# EAGLE design Stepper L647x (EAGLE 6.2)
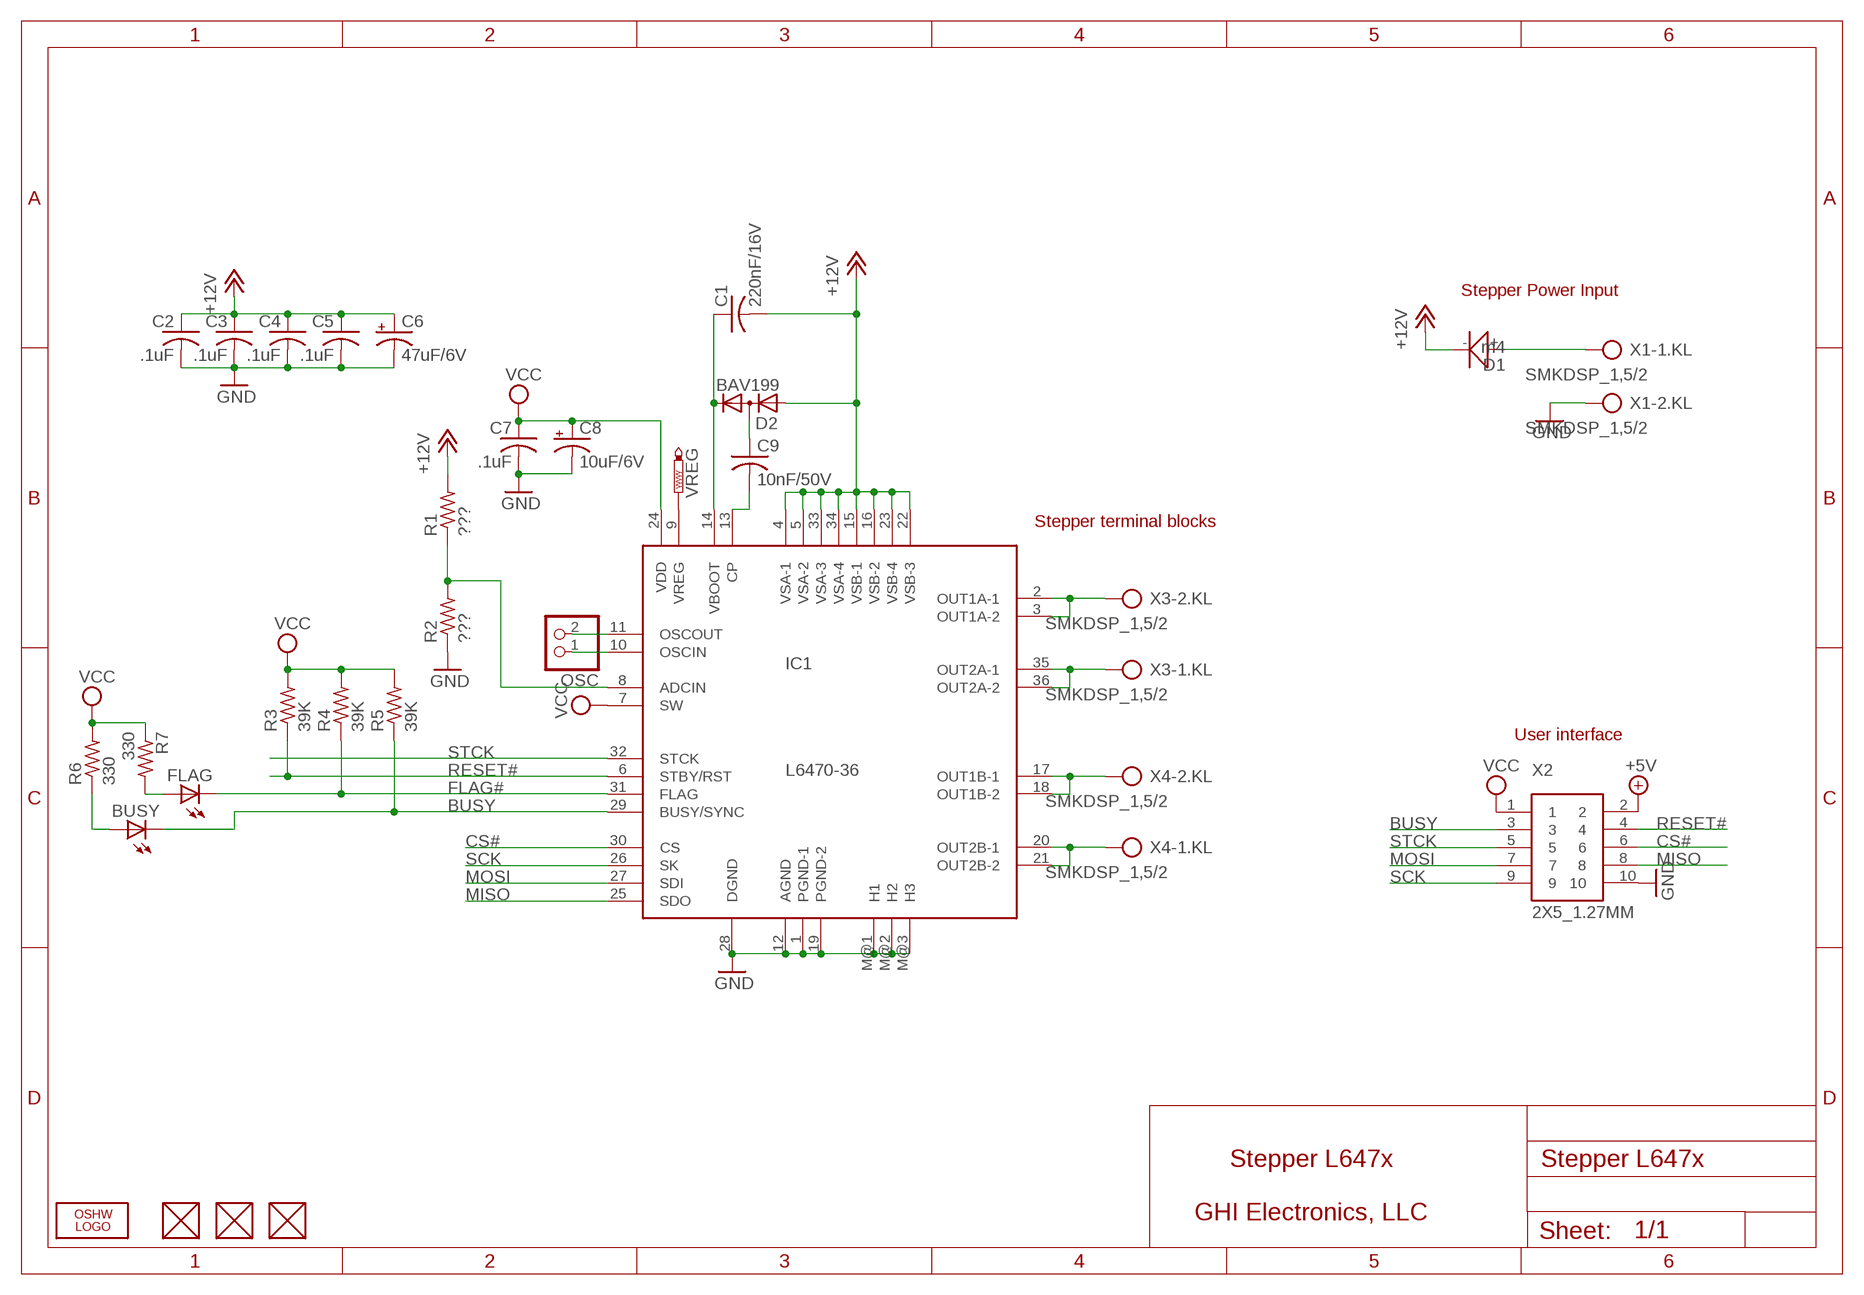
[diagram p0: schematic, sheet 1]

## Parts
BUSY  LEDCHIPLED_0805  [CHIPLED_0805]
C1  220nF/16V  C-USC0603K  [C0603K]
C2  .1uF  C-USC0603K  [C0603K]
C3  .1uF  C-USC0603K  [C0603K]
C4  .1uF  C-USC0603K  [C0603K]
C5  .1uF  C-USC0603K  [C0603K]
C6  47uF/6V  CPOL-USCT3528  [CT3528]
C7  .1uF  C-USC0603K  [C0603K]
C8  10uF/6V  CPOL-USCT3528  [CT3528]
C9  10nF/50V  C-USC0603K  [C0603K]
D1  m4  010-D2010  [D2010]
D2  BAV199  [SOT23]
FLAG  LEDCHIPLED_0805  [CHIPLED_0805]
FUD1  FIDUCIAL  [FIDUCIAL_40MIL]
FUD2  FIDUCIAL  [FIDUCIAL_40MIL]
FUD3  FIDUCIAL  [FIDUCIAL_40MIL]
IC1  L6470-36  [PSO36]
LOGO1  LOGO-OSHW-FILLX0200-NT  [OSHW_FILLX200_NOTEXT]
OSC  PINHD-1X2  [1X02]
R1  ???  R-US_R0603  [R0603]
R2  ???  R-US_R0603  [R0603]
R3  39K  R-US_R0603  [R0603]
R4  39K  R-US_R0603  [R0603]
R5  39K  R-US_R0603  [R0603]
R6  330  R-US_R0603  [R0603]
R7  330  R-US_R0603  [R0603]
VREG  PTR1PAD1-13  [P1-13]
X1  SMKDSP_1,5/2  [SMKDSP_1,5/2]
X2  2X5_1.27MM  [2X5_1.27MM]
X3  SMKDSP_1,5/2  [SMKDSP_1,5/2]
X4  SMKDSP_1,5/2  [SMKDSP_1,5/2]

## Nets
+5V [power]: X2.2
+12V: C1.2 C2.1 C3.1 C4.1 C5.1 C6.+ D1.- D2.1(A) IC1.4(VSA-1) IC1.5(VSA-2) IC1.15(VSB-1) IC1.16(VSB-2) IC1.22(VSB-3) IC1.23(VSB-4) IC1.33(VSA-3) IC1.34(VSA-4) R1.2
BUSY: BUSY.C IC1.29(BUSY/SYNC) R5.1 X2.3
CS#: IC1.30(CS) X2.6
FLAG#: FLAG.C IC1.31(FLAG) R4.1
GND: C2.2 C3.2 C4.2 C5.2 C6.- C7.2 C8.- IC1.1(PGND-1) IC1.12(AGND) IC1.19(PGND-2) IC1.28(DGND) IC1.M@1(H1) IC1.M@2(H2) IC1.M@3(H3) R2.1 X1.2 X2.10
MISO: IC1.25(SDO) X2.8
MOSI: IC1.27(SDI) X2.7
N$1: IC1.2(OUT1A-1) IC1.3(OUT1A-2) X3.2
N$2: IC1.35(OUT2A-1) IC1.36(OUT2A-2) X3.1
N$3: IC1.17(OUT1B-1) IC1.18(OUT1B-2) X4.2
N$4: C9.2 IC1.13(CP)
N$5: IC1.20(OUT2B-1) IC1.21(OUT2B-2) X4.1
N$6: D1.+ X1.1
N$7: C9.1 D2.3(AC)
N$8: C1.1 D2.2(C) IC1.14(VBOOT)
N$9: IC1.9(VREG) VREG.TP
N$10: FLAG.A R7.2
N$12: IC1.10(OSCIN) OSC.1
N$14: IC1.11(OSCOUT) OSC.2
N$16: IC1.8(ADCIN) R1.1 R2.2
N$18: BUSY.A R6.1
RESET#: IC1.6(STBY/RST) R3.1 X2.4
SCK: IC1.26(SK) X2.9
STCK: IC1.32(STCK) X2.5
VCC: C7.1 C8.+ IC1.7(SW) IC1.24(VDD) R3.2 R4.2 R5.2 R6.2 R7.1 X2.1
Unconnected: FUD1.P$1 FUD2.P$1 FUD3.P$1

## Notes on the sheet
- Stepper Power Input
- Stepper terminal blocks
- User interface
- Stepper L647x
- GHI Electronics, LLC

## Library data of the parts
BUSY FLAG = led:LED: LED OSRAM: - CHIPLED LG R971, LG N971, LY N971, LG Q971, LY Q971, LO R971, LY R971 LH N974, LH R974 LS Q976, LO Q976, LY Q976 LO Q996 - Hyper CHIPLED LW Q18S LB Q993, LB Q99A, LB R99A - SideLED LS A670, LO A670, LY A670, LG A670, LP A670 LB A673, LV A673, LT A673, LW A673 LH A674 LY A675 LS A676, LA A676, LO A676, LY A676, LW A676 LS A679, LY A679, LG A679 - Hyper Micro SIDELED® LS Y876, LA Y876, LO Y876, LY Y876 LT Y87S - SmartLED LW L88C, LW L88S LB L89C, LB L89S, LG L890 LS L89K, LO L89K, LY L89K LS L896, LA L896, LO L896, LY L896 - TOPLED LS T670, LO T670, LY T670, LG T670, LP T670 LSG T670, LSP T670, LSY T670, LOP T670, LYG T670 LG T671, LOG T671, LSG T671 LB T673, LV T673, LT T673, LW T673 LH T674 LS T676, LA T676, LO T676, LY T676, LB T676, LH T676, LSB T676, LW T676 LB T67C, LV T67C, LT T67C, LS T67K, LO T67K, LY T67K, LW E67C LS E67B, LA E67B, LO E67B, LY E67B, LB E67C, LV E67C, LT E67C LW T67C LS T679, LY T679, LG T679 LS T770, LO T770, LY T770, LG T770, LP T770 LB T773, LV T773, LT T773, LW T773 LH T774 LS E675, LA E675, LY E675, LS T675 LS T776, LA T776, LO T776, LY T776, LB T776 LHGB T686 LT T68C, LB T68C - Hyper Mini TOPLED® LB M676 - Mini TOPLED Santana® LG M470 LS M47K, LO M47K, LY M47K Source: http://www.osram.convergy.de LUXEON: - LUMILED® LXK2-PW12-R00, LXK2-PW12-S00, LXK2-PW14-U00, LXK2-PW14-V00 LXK2-PM12-R00, LXK2-PM12-S00, LXK2-PM14-U00 LXK2-PE12-Q00, LXK2-PE12-R00, LXK2-PE12-S00, LXK2-PE14-T00, LXK2-PE14-U00 LXK2-PB12-K00, LXK2-PB12-L00, LXK2-PB12-M00, LXK2-PB14-N00, LXK2-PB14-P00, LXK2-PB14-Q00 LXK2-PR12-L00, LXK2-PR12-M00, LXK2-PR14-Q00, LXK2-PR14-R00 LXK2-PD12-Q00, LXK2-PD12-R00, LXK2-PD12-S00 LXK2-PH12-R00, LXK2-PH12-S00 LXK2-PL12-P00, LXK2-PL12-Q00, LXK2-PL12-R00 Source: www.luxeon.com KINGBRIGHT: KA-3528ASYC Source: www.kingbright.com
C1-C5 C7 C9 = rcl:C-US: CAPACITOR, American symbol
C6 C8 = rcl:CPOL-US: POLARIZED CAPACITOR, American symbol
D1 = Discrete:010-D*
D2 = diode:BAV199: DIODE low-leakage double diode
FUD1-FUD3 = GHI:FIDUCIAL
IC1 = GHI:L6470-36
LOGO1 = Logo:LOGO-OSHW-FILL
OSC = pinhead:PINHD-1X2: PIN HEADER
R1-R7 = rcl:R-US_: RESISTOR, American symbol
VREG = testpad:PTR1: TEST PIN
X1 X3 X4 = GHI2:SMKDSP_1,5/2: For Blue Wire Connector Block
X2 = GHI:2X5_1.27MM

## Net classes
0 default: width 0.254 mm, drill 0.381 mm, clearance 0.203 mm

## Board
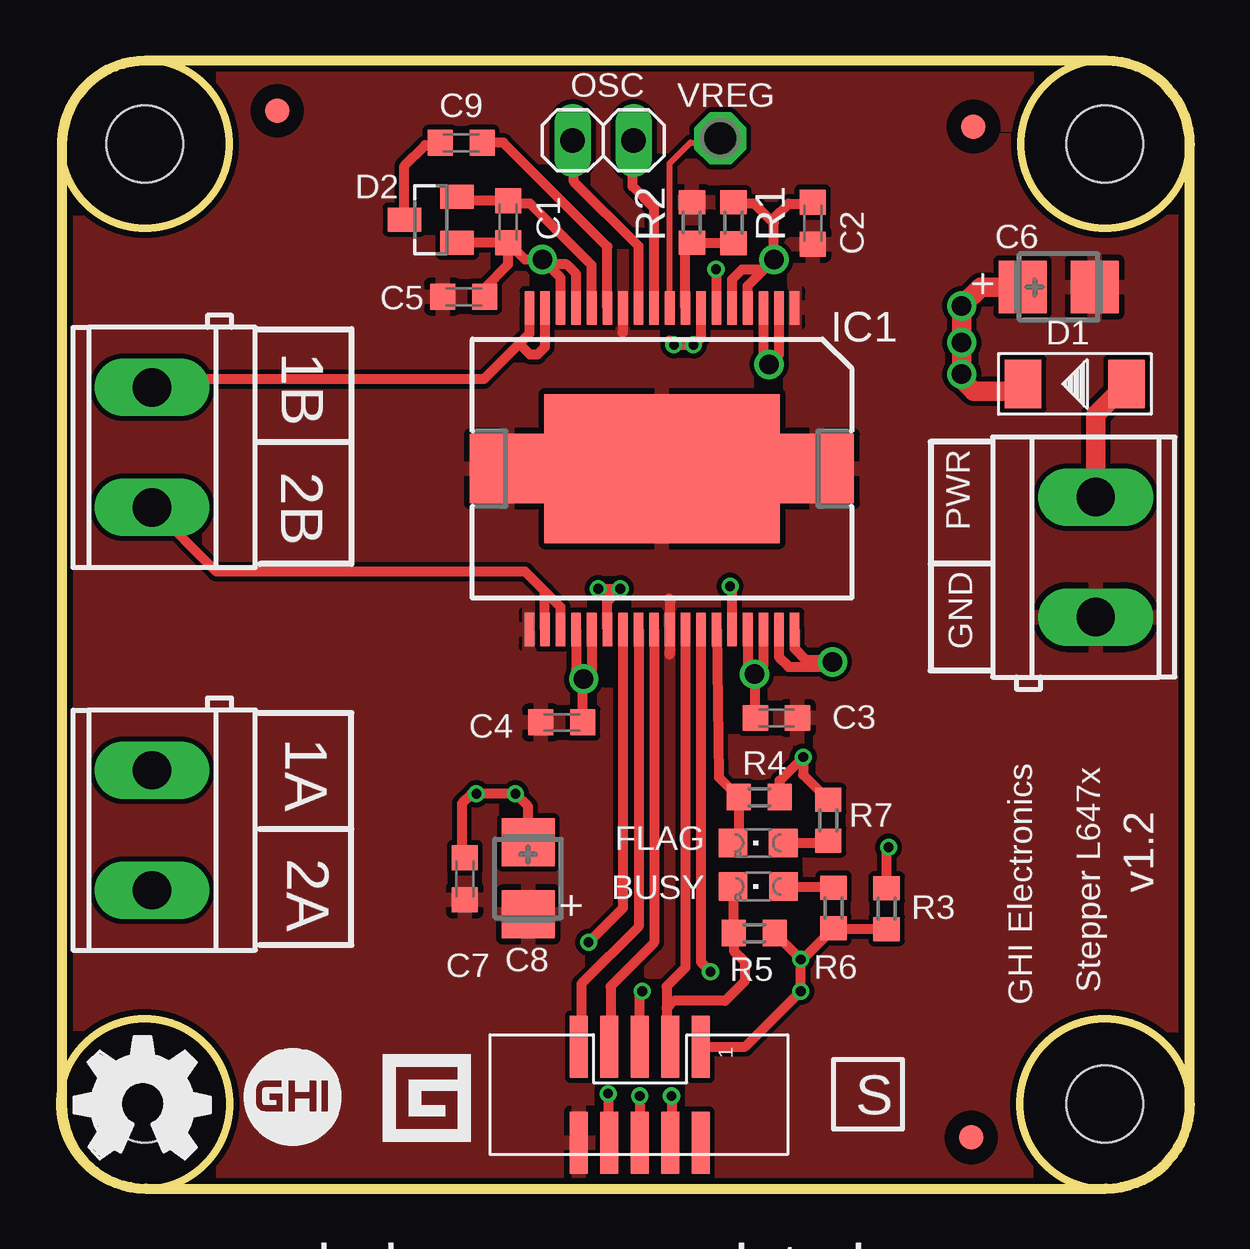
[diagram p1: board, top side]
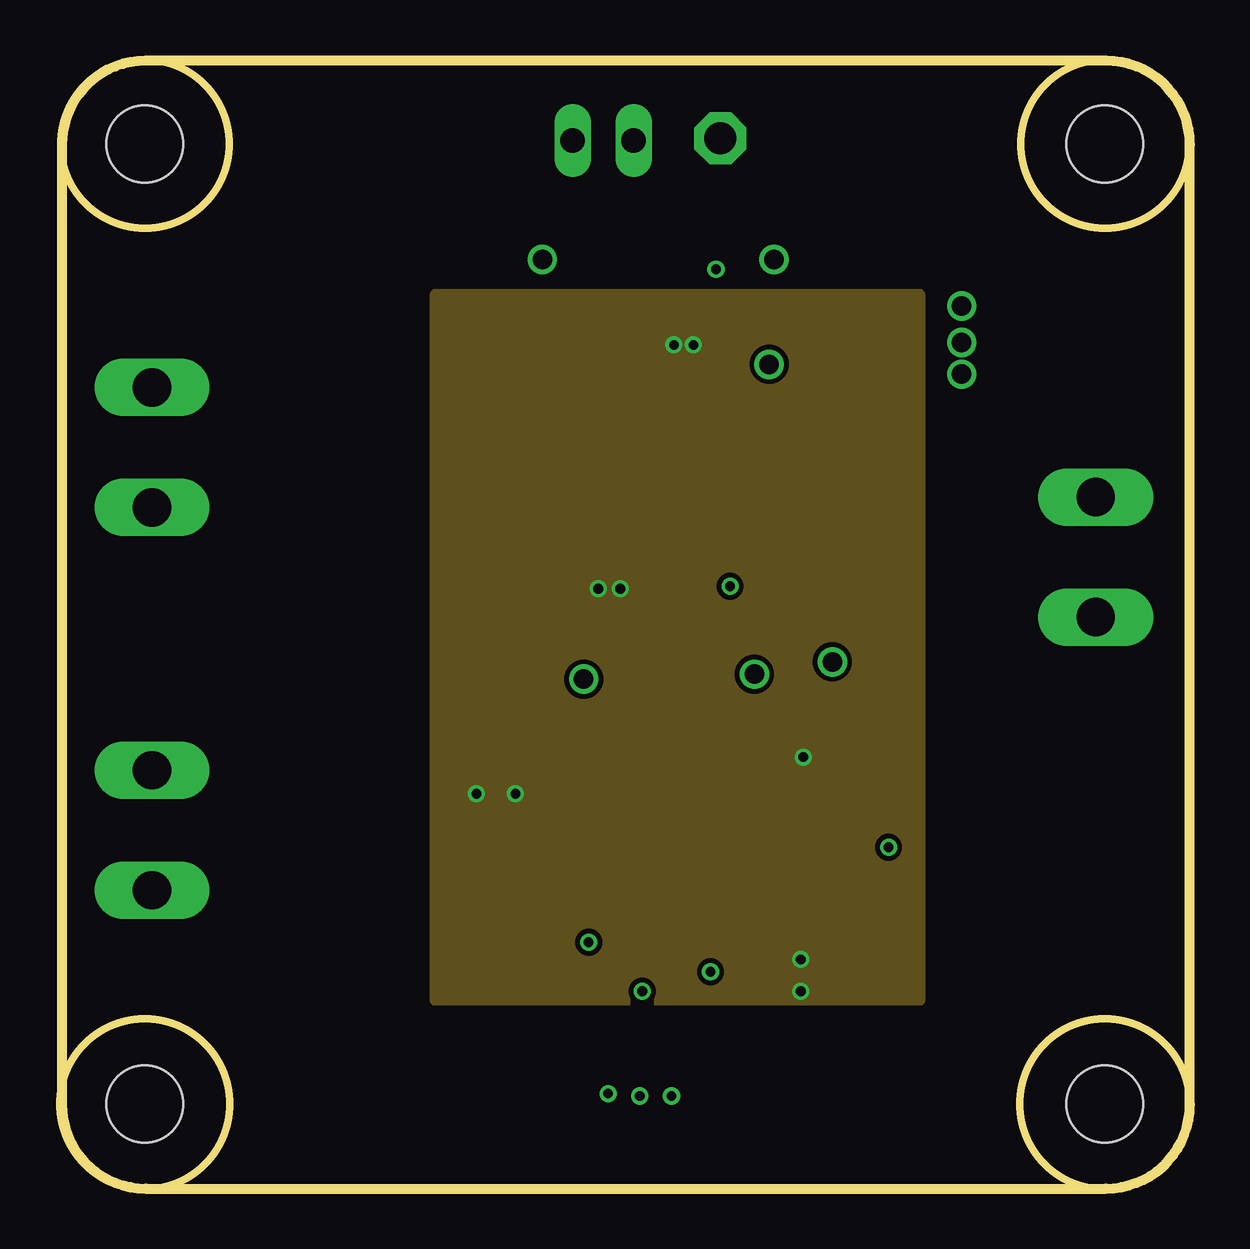
[diagram p2: board, inner layer 3.3v]
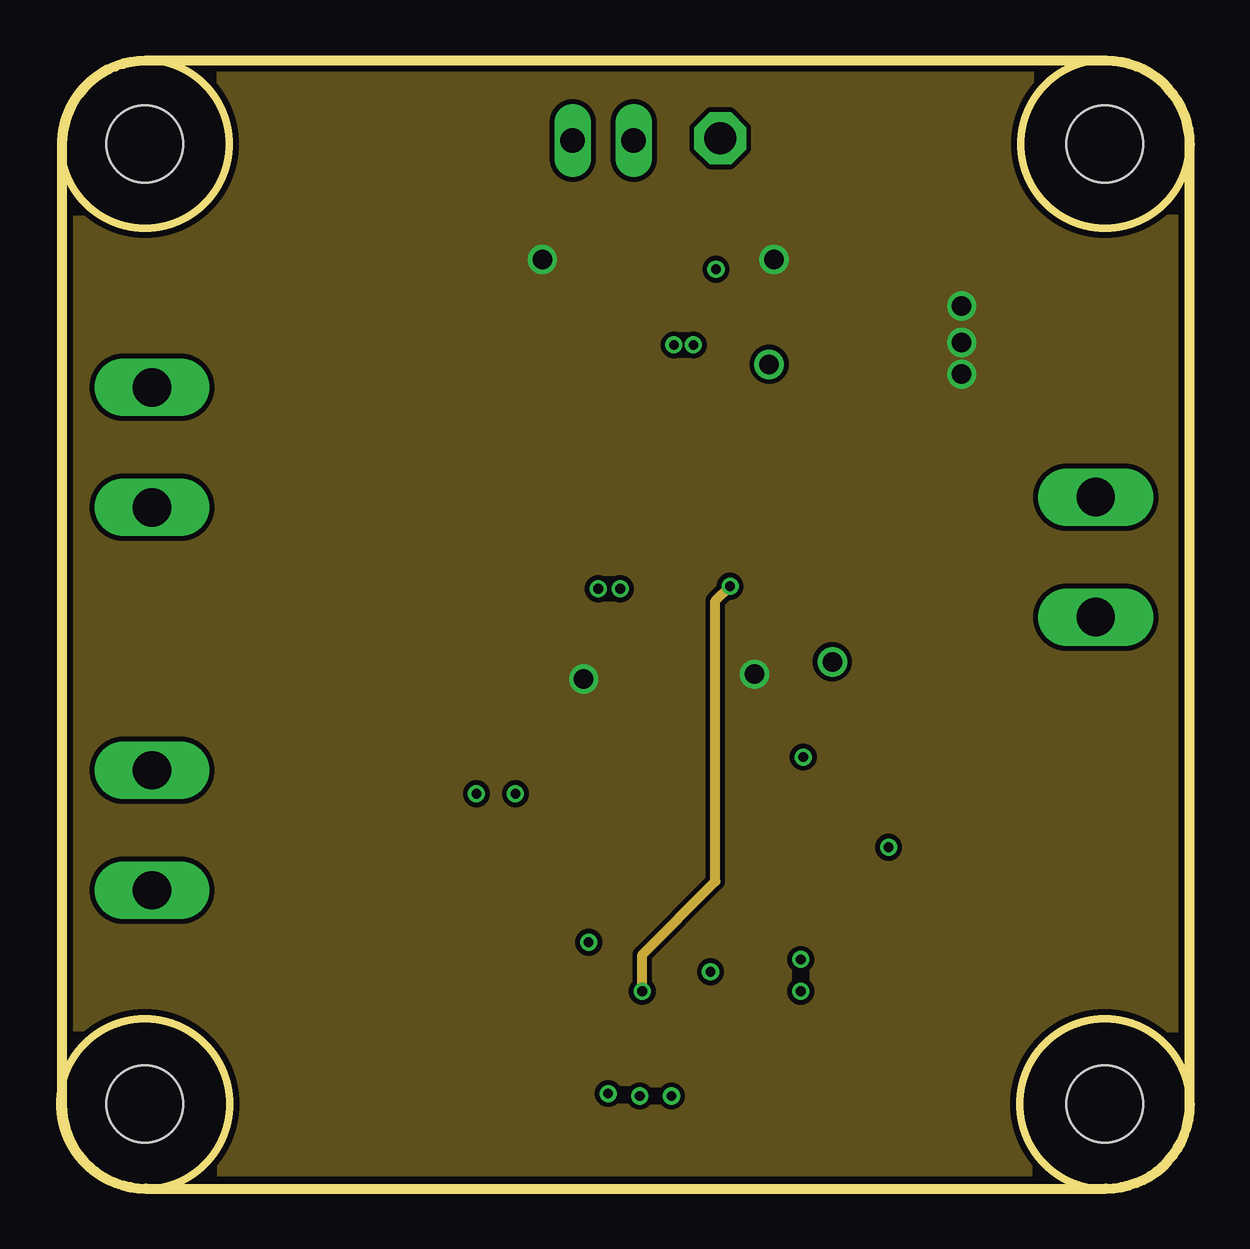
[diagram p3: board, inner layer 12v]
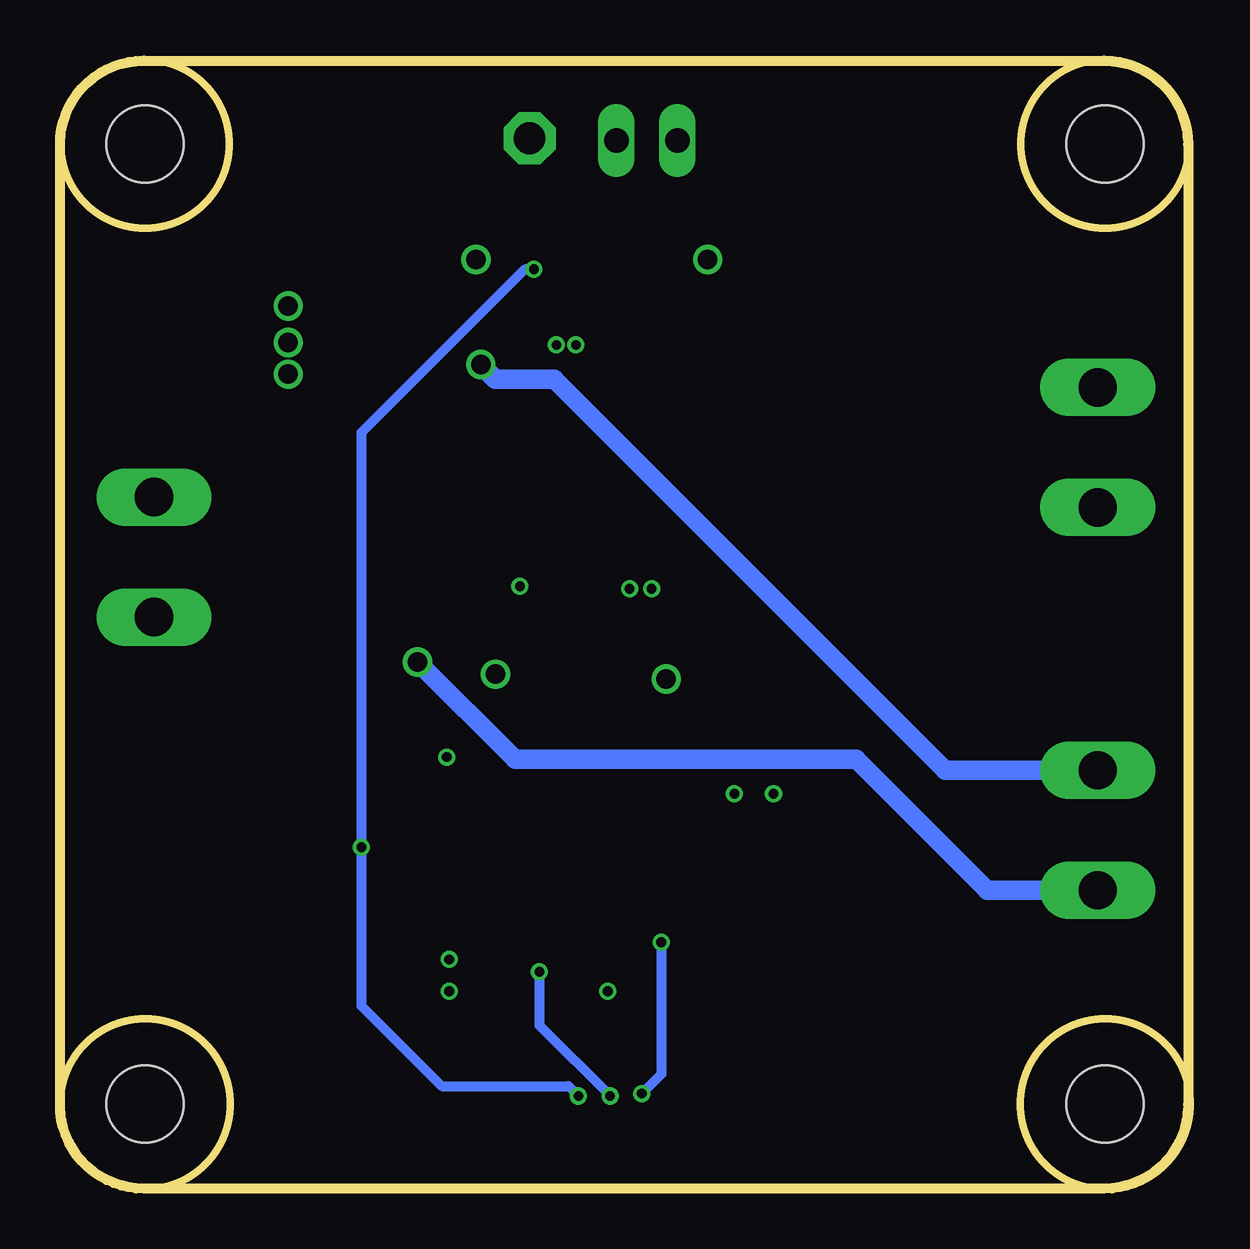
[diagram p4: board, bottom side, seen from below]

Size 47.08 x 47.04 mm. Coordinates in mm from the lower left corner, seen from the top.
Outline: 43.58,0.01 arc90 47.08,3.51 47.08,43.51 arc90 43.58,47.01 3.58,47.01 arc90 0.08,43.51 0.08,3.51 arc90 3.58,0.01 43.58,0.01
Outline: circle at 3.54,43.54 radius 3.5
Outline: circle at 43.54,43.54 radius 3.5
Outline: circle at 43.54,3.54 radius 3.54
Outline: circle at 3.54,3.54 radius 3.54
Copper layers (1+2+15+16): Top 0.035mm / dielectric 1.5mm / 3.3v 0.035mm / dielectric 0.15mm / 12v 0.035mm / dielectric 0.2mm / Bottom 0.035mm
Design rules: minimum track width 6mil, minimum drill 12mil, track to track 6mil, track to pad 6mil, pad to pad 6mil, via to via 6mil, smd to smd 0mil, copper to edge 10mil, drill to drill 10mil, minimum pad ring 10mil, minimum via ring 6mil, stop-mask expansion 2mil, vias tented up to drill 100mil, thermal gap 10mil
Holes 3.2 mm at 3.54,3.54 43.54,43.54 3.54,43.54 43.54,3.54

### Footprints (pad centres in the part's own frame; a part is rotated, then mirrored left to right if it is on the bottom)
CHIPLED_0805 = smd 1.2 x 1.2: A 0,-1.05; C 0,1.05
C0603K = smd 1.05 x 1.08: 1 -0.875,0; 2 0.875,0
CT3528 = smd 2 x 2.2: + -1.5,0; - 1.5,0
D2010 = smd 1.524 x 2.032: + -2.159,0; - 2.159,0
SOT23 = smd 1 x 1.4: 1 -0.95,-1.1; 2 0.95,-1.1; 3 0,1.1
FIDUCIAL_40MIL = smd 1.016 x 1.016: P$1 0,0
PSO36 = smd 0.4 x 1.4: 1 -5.525,-6.7; 2 -4.875,-6.7; 3 -4.225,-6.7; 4 -3.575,-6.7; 5 -2.925,-6.7; 6 -2.275,-6.7; 7 -1.625,-6.7; 8 -0.975,-6.7; 9 -0.325,-6.7; 10 0.325,-6.7; 11 0.975,-6.7; 12 1.625,-6.7; 13 2.275,-6.7; 14 2.925,-6.7; 15 3.575,-6.7; 16 4.225,-6.7; 17 4.875,-6.7; 18 5.525,-6.7; 19 5.525,6.7; 20 4.875,6.7; 21 4.225,6.7; 22 3.575,6.7; 23 2.925,6.7; 24 2.275,6.7; 25 1.625,6.7; 26 0.975,6.7; 27 0.325,6.7; 28 -0.325,6.7; 29 -0.975,6.7; 30 -1.625,6.7; 31 -2.275,6.7; 32 -2.925,6.7; 33 -3.575,6.7; 34 -4.225,6.7; 35 -4.875,6.7; 36 -5.525,6.7 | smd 9.8 x 6.2: M@1 0,0 | smd 3.1 x 2.9: M@2 -6.45,0; M@3 6.45,0
1X02 = drill 1.016 long: 1 -1.27,0; 2 1.27,0
R0603 = smd 1 x 1.1: 1 -0.85,0; 2 0.85,0
P1-13 = drill 1.321 pad 2.159 octagon: TP 0,0
SMKDSP_1,5/2 = drill 1.6 pad 1.8 long: 1 -2.5,0; 2 2.5,0
2X5_1.27MM = smd 2.6 x 0.74: 1 -2,2.58; 2 2,2.58; 3 -2,1.31; 4 2,1.31; 5 -2,0.04; 6 2,0.04; 7 -2,-1.23; 8 2,-1.23; 9 -2,-2.5; 10 2,-2.5

### Placement (x,y rotation side)
BUSY  29.09,12.59 90 top
C1  18.68,40.29 270 top
C2  31.36,40.24 270 top
C3  29.85,19.62 0 top
C4  20.9,19.43 180 top
C5  16.82,37.18 180 top
C6  41.61,37.58 0 top
C7  16.87,12.92 270 top
C8  19.51,12.93 270 top
C9  16.71,43.59 0 top
D1  42.29,33.54 180 top
D2  15.45,40.38 90 top
FLAG  29.09,14.41 90 top
FUD1  38.06,44.26 0 top
FUD2  37.97,2.14 0 top
FUD3  9.05,44.92 0 top
IC1  25.08,30.01 180 top
LOGO1  0.6,1.26 0 top
OSC  22.63,43.68 180 top
R1  28.06,40.26 90 top
R2  26.33,40.26 270 top
R3  34.44,11.67 270 top
R4  29.13,16.32 0 top
R5  28.93,10.65 0 top
R6  32.23,11.7 270 top
R7  32.01,15.36 270 top
VREG  27.51,43.77 0 top
X1  43.16,26.32 270 top
X2  24.12,3.92 270 top
X3  3.84,14.94 90 top
X4  3.84,30.89 90 top

### Tracks (layer width: path | path; a pad name or v marks a point on that pad's centre or on a via)
+12V  (via drill 0.81)
  Top 0.406: C1.2 18.69,39.43 D2.1 | C5.1 17.69,37.54 18.67,38.51 C1.2 | IC1.16 20.85,37.96 v20.09,38.72 | v20.09,38.72 19.38,38.72 C1.2 | IC1.15 21.5,38.12 21.11,38.51 20.3,38.51 v20.09,38.72 | IC1.4 28.65,37.63 29.34,38.31 | 29.34,38.31 v29.75,38.72 29.75,40.24 | 29.75,40.24 28.93,41.05 28.09,41.05 R1.2 | 29.75,40.24 29.75,40.45 30.36,41.05 31.3,41.05 C2.1 | IC1.5 28,37.89 28.43,38.31 29.34,38.31 | IC1.22 21.5,21.66 21.82,21.34 v21.82,21.24 | IC1.23 22.15,21.58 v21.82,21.24 | IC1.33 28.65,21.73 v28.93,21.45 | IC1.34 29.3,21.82 v28.93,21.45 | C4.1 21.78,21.2 v21.82,21.24 | C3.1 28.98,21.4 v28.93,21.45
  Top 0.813: C6.+ 38.36,37.58 v37.57,36.79 v37.57,35.26 v37.57,33.94 37.57,33.74 38.08,33.23 39.82,33.23 D1.-
  pour 12v: 47,47.05 47,0.82 0.59,0.82 0.59,47.05
BUSY
  Top 0.406: IC1.29 26.05,9.22 25.28,8.44 25.28,7.53 | 25.28,7.53 25.28,6.07 X2.3 | 25.28,7.53 25.58,7.83 27.71,7.83 28.53,8.64 28.53,9.46 28.08,9.91 R5.1 28.08,12.56 BUSY.C
CS#  (via drill 0.41)
  Top 0.406: IC1.30 26.7,9.45 v27.11,9.05 | v24.16,3.87 X2.6
  Bottom 0.406: v27.11,9.05 27.11,6.82 v24.16,3.87
FLAG#
  Top 0.406: IC1.31 27.46,17.15 R4.1 28.28,14.65 FLAG.C
GND
  Top 0.406: IC1.12 23.45,35.68 23.45,35.67 | IC1.28 25.4,22.39 | 25.4,22.39 25.4,22.26 | 25.4,22.39 25.43,22.46 25.43,24.49 25.38,24.6
  pour Top: 47.1,0.21 47.1,46.74 0.18,46.74 0.18,0.21
MISO  (via drill 0.41)
  Top 0.406: IC1.25 23.45,11.7 v22.03,10.27 | v22.84,3.97 22.84,1.97 X2.8
  Bottom 0.406: v22.03,10.27 22.03,4.78 v22.84,3.97
MOSI
  Top 0.406: IC1.27 24.75,10.26 22.94,8.44 22.94,5.97 X2.7
N$1  (via drill 0.81)
  Top 0.406: IC1.3 29.3,34.59 v29.54,34.35 29.95,34.76 IC1.2
  Bottom 0.813: X3.2 10.2,17.44 26.5,33.74 28.93,33.74 v29.54,34.35
N$2  (via drill 0.81)
  Top 0.406: IC1.36 30.6,22.52 31.07,22.06 32.08,22.06 v32.19,21.95 31.98,21.75 30.36,21.75 29.95,22.15 IC1.35
  Bottom 0.813: X3.1 8.45,12.44 13.9,17.89 28.12,17.89 v32.19,21.95
N$3
  Top 0.406: IC1.18 19.55,35.64 19.13,35.21 | 19.13,35.21 17.66,33.74 4.18,33.74 X4.2 | IC1.17 20.2,35.07 19.89,34.76 19.59,34.76 19.13,35.21
N$4
  Top 0.406: IC1.13 22.8,39.26 18.47,43.59 C9.2
N$5
  Top 0.406: IC1.20 20.2,24.89 | 20.2,24.89 19.38,25.71 6.52,25.71 X4.1 | IC1.21 20.85,24.24 20.2,24.89
N$6
  Top 0.813: X1.1 43.16,32.25 D1.+
N$7
  Top 0.406: D2.3 14.35,42.62 15.22,43.49 15.75,43.49 C9.1
N$8
  Top 0.406: D2.2 16.71,41.17 C1.1 18.79,41.05 19.59,41.05 22.15,38.49 IC1.14
N$9
  Top 0.254: IC1.9 25.4,42.73 26.27,43.59 27.33,43.59 VREG.TP
N$10
  Top 0.406: FLAG.A 31.92,14.41 R7.2
N$12
  Top 0.406: IC1.10 24.75,40.87 23.85,41.77 23.85,43.64 OSC.1
N$14
  Top 0.406: IC1.11 24.1,39.28 21.42,41.97 21.42,43.63 OSC.2
N$16
  Top 0.406: IC1.8 26.05,39.52 R2.2 28.16,39.41 R1.1
N$18
  Top 0.406: BUSY.A 32.18,12.59 R6.1
RESET#  (via drill 0.41)
  Top 0.406: IC1.6 27.35,38.06 v27.33,38.31 | v25.48,3.87 25.48,1.97 X2.4 | R3.1 34.44,14.15 v34.52,14.23
  Bottom 0.406: v27.33,38.31 27.71,38.31 34.52,31.5 v34.52,14.23 34.52,7.63 31.17,4.28 25.89,4.28 v25.48,3.87
SCK
  Top 0.406: IC1.26 24.1,10.93 21.72,8.54 21.72,6.02 X2.9
STCK  (via drill 0.41)
  Top 0.406: X2.5 24.16,8.14 v24.26,8.24 | IC1.32 28,25.02 v27.92,25.1
  12v 0.406: v24.26,8.24 24.26,9.76 27.31,12.81 27.31,24.49 v27.92,25.1
VCC  (via drill 0.41)
  Top 0.406: R4.2 29.98,17.01 v30.97,17.99 30.97,17.25 R7.1 | IC1.24 22.8,24.63 v22.43,25 v23.35,25 22.84,24.49 | R5.2 29.78,10.65 v30.86,9.56 | v30.86,9.56 30.94,9.56 R6.2 32.26,10.82 R3.2 | 25.4,35.34 v25.58,35.16 v26.39,35.16 26.7,35.47 IC1.7 | X2.1 28.55,5.92 v30.86,8.24 v30.86,9.56 | C8.+ 19.51,15.94 v18.98,16.47 v17.35,16.47 17.15,16.47 16.74,16.06 16.74,13.92 C7.1
  pour 3.3v: 35.84,37.3 35.84,7.83 15.62,7.83 15.62,37.3

### Text on the board
tPlace: + | 1B | 2B | PWR | GND | 1A | 2A | v1.2 | + | GHI Electronics | Stepper L647x | S | corner holes are non-plated | Black PCB with white print | Do not add any manufacturing Code!
bPlace: No text on back side